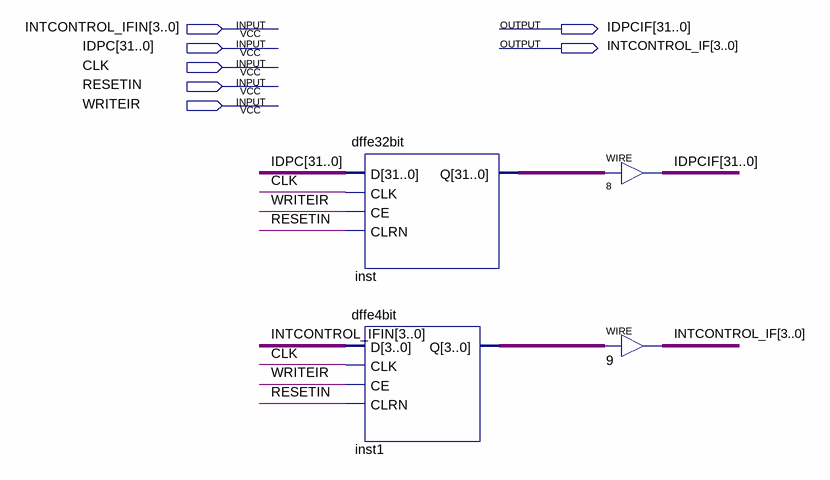
[diagram p0: schematic sheet]
// Quartus schematic IF-ID-INT-BUFFER.bdf as structural Verilog: 4 symbols, 7 pins
module \IF-ID-INT-BUFFER  (
  input  [3:0] INTCONTROL_IFIN,
  input  [31:0] IDPC,
  input  CLK,
  input  RESETIN,
  input  WRITEIR,
  output [31:0] IDPCIF,
  output [3:0] INTCONTROL_IF
);

  wire [3:0] inst1_q;
  wire [31:0] inst_q;

  dffe32bit inst (.D(IDPC), .CLK(CLK), .CE(WRITEIR), .CLRN(RESETIN), .Q(inst_q));
  dffe4bit inst1 (.D(INTCONTROL_IFIN), .CLK(CLK), .CE(WRITEIR), .CLRN(RESETIN), .Q(inst1_q));
  assign IDPCIF = inst_q;  // WIRE 8
  assign INTCONTROL_IF = inst1_q;  // WIRE 9
endmodule
